# EasyEDA Pro project 2024_01_03_bar_IO_module.eprj

# Schematic Schematic1_1
Create Date: 2024-01-04; Page Name: P1; Project Name: 2024_01_03_bar_IO_module; Schematic Name: Schematic1_1; Update Date: 2024-01-04; Company: EasyEDA.com; Drawed: EasyEDA Pro; Page Size: A4; Part Number: JLCPCB-002; Reviewed: EasyEDA Pro; Version: V0.1
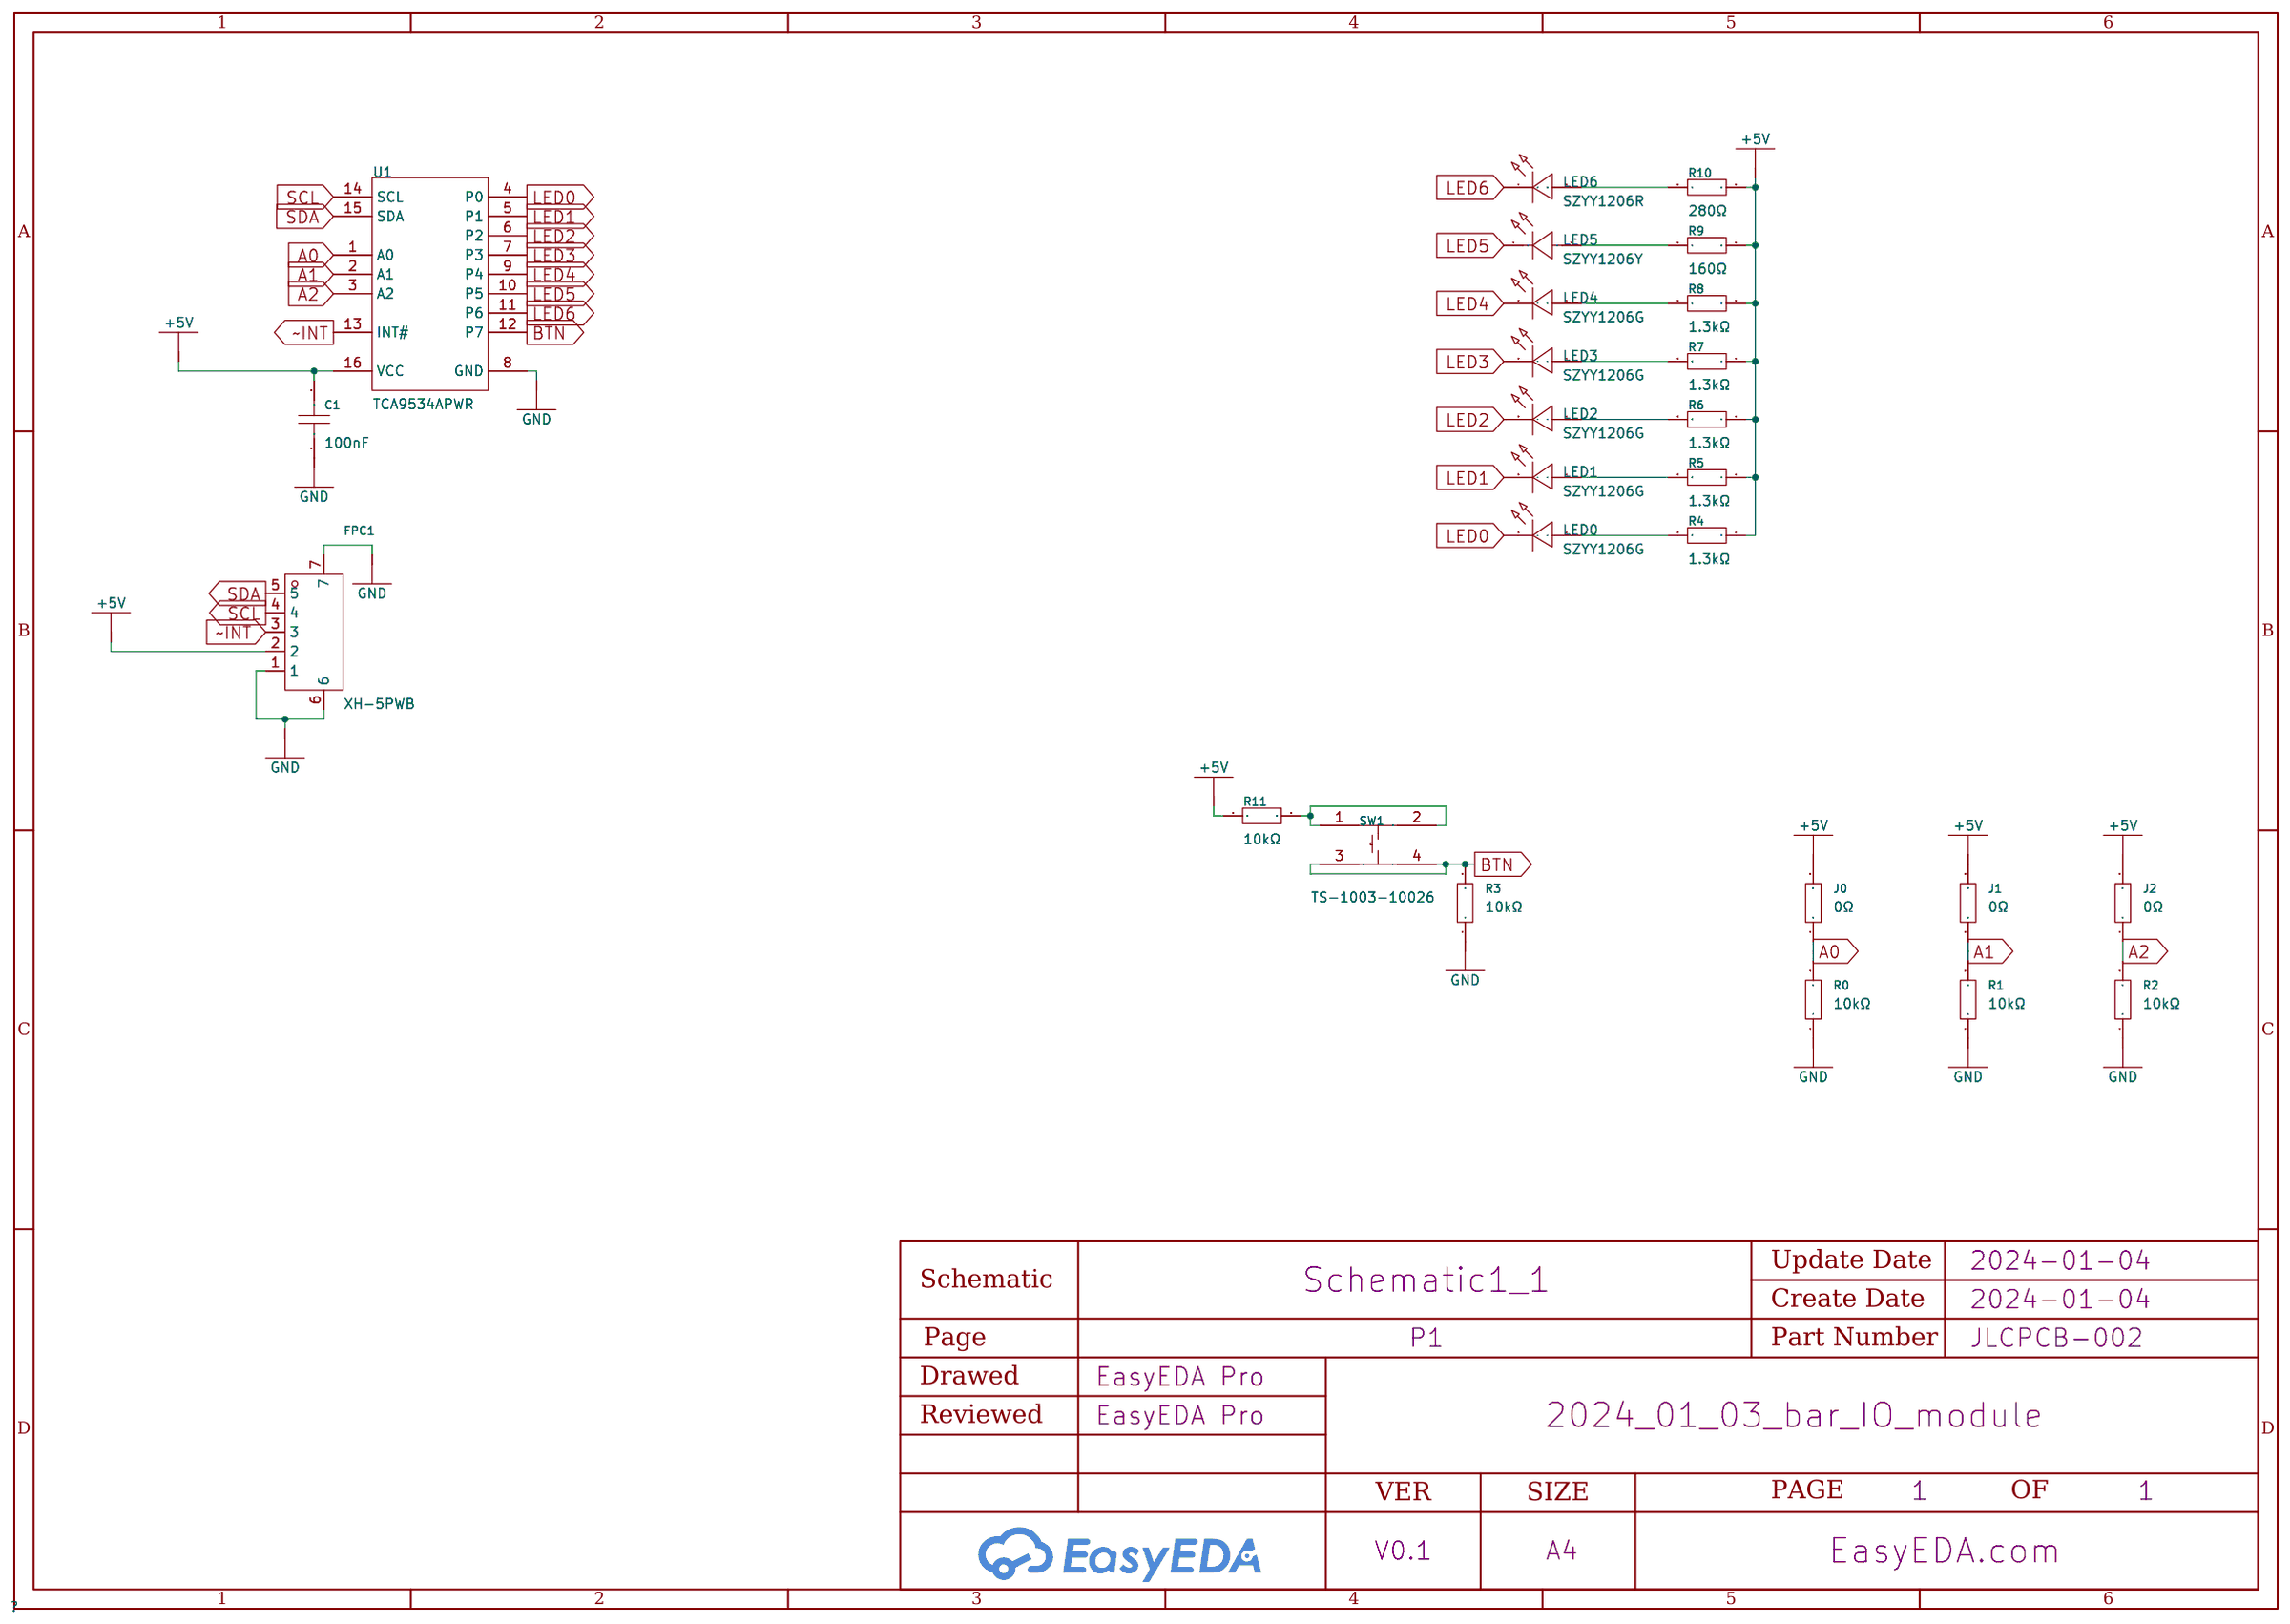
[diagram p0: schematic sheet]

## Parts
C1  100nF  [C0603]
FPC1  XH-5PWB  [CONN-SMD_5P-P2.50_DEALON_XH-5PWB]
J0  0Ω  [R0805]
J1  0Ω  [R0805]
J2  0Ω  [R0805]
LED0  SZYY1206G  [LED1206-R-RD]
LED1  SZYY1206G  [LED1206-R-RD]
LED2  SZYY1206G  [LED1206-R-RD]
LED3  SZYY1206G  [LED1206-R-RD]
LED4  SZYY1206G  [LED1206-R-RD]
LED5  SZYY1206Y  [LED1206-R-RD]
LED6  SZYY1206R  [LED1206-R-RD]
R0  10kΩ  [R0603]
R1  10kΩ  [R0603]
R2  10kΩ  [R0603]
R3  10kΩ  [R0603]
R4  1.3kΩ  [R0603]
R5  1.3kΩ  [R0603]
R6  1.3kΩ  [R0603]
R7  1.3kΩ  [R0603]
R8  1.3kΩ  [R0603]
R9  160Ω  [R0603]
R10  280Ω  [R0603]
R11  10kΩ  [R0603]
SW1  TS-1003-10026  [SW-TH_4P-L12.0-W12.0-P5.00-LS12.5]
U1  TCA9534APWR  [TSSOP-16_L5.0-W4.4-P0.65-LS6.4-BL]

## Library data of the parts
C1 = HMK107B7104KAHT: Capacitance: Tolerance:±10% Tolerance:±10% Voltage Rated: Temperature Coefficient:; LCSC Part Name: 100nF ±10% 100V MBASH168SB7104KTNA01; Supplier Part: C268011; Manufacturer: TAIYO YUDEN(太诱); Supplier Footprint: 0603; JLCPCB Part Class: Extended Part; Datasheet: https://atta.szlcsc.com/upload/public/pdf/source/20180820/C268011_073FA47FA3BE608543F06897344E2736.pdf; Supplier: LCSC; Tolerance: ±10%
FPC1 = XH-5PWB: Pins Structure:1x5P Pitch:2.5mm Mounting Style:Surface Mount Row Spacing:- Number of Pins:5P Number of Rows:1 Number of PINs Per Row:5 Reference Series:XH Current Rating (Max):3A Operating Temperature Range:-25℃~+85℃ Operating Temperature Range:-25℃~+85℃; LCSC Part Name: 1x5P 间距:2.5mm 卧贴 系列:XH; Supplier Part: C2905027; Manufacturer: DEALON(德艺隆); Supplier Footprint: SMD,P=2.5mm,卧贴; JLCPCB Part Class: Extended Part; Datasheet: https://atta.szlcsc.com/upload/public/pdf/source/20211025/6C2B75DB1AEBD099C7E95723735B67A6.pdf; Supplier: LCSC; Pins Structure: 1x5P; Pitch: 2.5mm; Mounting Style: Surface Mount; Number of Pins: 5P; Number of Rows: 1; Number of PINs Per Row: 5; Reference Series: XH; Current Rating (Max): 3A; Operating Temperature Range: -25℃~+85℃
J0-J2 = 0805W8F1002T5E: Resistance:10000Ω Tolerance:±1% Tolerance:±1% Power(Watts): Overload Voltage (Max): Temperature Coefficient:±100ppm/℃ Temperature Coefficient:±100ppm/℃ Type:Thick Film Resistors Operating Temperature Range:-55℃~+155℃ Operating Temperature Range:-55℃~+155℃; LCSC Part Name: 10kΩ ±1% 125mW 厚膜电阻; Supplier Part: C17414; Manufacturer: UNI-ROYAL(厚声); Supplier Footprint: 0805; JLCPCB Part Class: Basic Part; Datasheet: https://atta.szlcsc.com/upload/public/pdf/source/20200306/C422600_1E6D84923E4A46A82E41ADD87F860B5C.pdf; Supplier: LCSC; Tolerance: ±1%; Temperature Coefficient: ±100ppm/℃; Type: Thick Film Resistors; Operating Temperature Range: -55℃~+155℃
LED0-LED4 = SZYY1206G: Emitted Color:Emerald; LCSC Part Name: 翠绿; Supplier Part: C434439; Manufacturer: yongyu(永裕光电); Supplier Footprint: 1206; JLCPCB Part Class: Extended Part; Datasheet: https://atta.szlcsc.com/upload/public/pdf/source/20200628/C434439_0A6287F1EA2604FB8C8003896F01CB92.pdf; Supplier: LCSC; Emitted Color: Emerald
LED5 = SZYY1206Y: Emitted Color:yellow Diode Configuration:- Lens Color:Colorless transparence Dominant Wavelength:584nm~594nm Dominant Wavelength:584nm~594nm Peak Wavelength:596nm Color Temperature:- Color Temperature:- Forward Current:10mA Power Dissipation:40mW Viewing; LCSC Part Name: 黄灯; Supplier Part: C434443; Manufacturer: yongyu(永裕光电); Supplier Footprint: 1206; JLCPCB Part Class: Extended Part; Datasheet: https://atta.szlcsc.com/upload/public/pdf/source/20200827/C434443_5A3E9BDFE35964C13174CBFD2349B1CE.pdf; Supplier: LCSC; Emitted Color: yellow; Lens Color: Colorless transparence; Dominant Wavelength: 584nm~594nm; Peak Wavelength: 596nm; Forward Current: 10mA; Power Dissipation: 40mW; Viewing Angle: 120°; Operating Temperature: -40℃~+85℃
LED6 = SZYY1206R: Emitted Color:红灯 Diode Configuration:- Lens Color:Colorless transparence Dominant Wavelength:615nm~630nm Dominant Wavelength:615nm~630nm Peak Wavelength:645nm Color Temperature:- Color Temperature:- Forward Current:20mA Power Dissipation:40mW Viewing Angl; LCSC Part Name: 红灯; Supplier Part: C434438; Manufacturer: yongyu(永裕光电); Supplier Footprint: 1206; JLCPCB Part Class: Extended Part; Datasheet: https://atta.szlcsc.com/upload/public/pdf/source/20200628/C434438_2D67D2A0D30E1ECD9789F51185A39ACF.pdf; Supplier: LCSC; Emitted Color: 红灯; Lens Color: Colorless transparence; Dominant Wavelength: 615nm~630nm; Peak Wavelength: 645nm; Forward Current: 20mA; Power Dissipation: 40mW; Viewing Angle: 120°; Operating Temperature: -40℃~+85℃
R0-R3 R11 = 0603WAF1002T5E: Resistance:10000Ω Tolerance:±1% Tolerance:±1% Power(Watts): Overload Voltage (Max): Temperature Coefficient:±100ppm/℃ Temperature Coefficient:±100ppm/℃ Type:Thick Film Resistors Operating Temperature Range:-55℃~+155℃ Operating Temperature Range:-55℃~+155℃; LCSC Part Name: 10kΩ ±1% 100mW 厚膜电阻; Supplier Part: C25804; Manufacturer: UNI-ROYAL(厚声); Supplier Footprint: 0603; JLCPCB Part Class: Basic Part; Datasheet: https://atta.szlcsc.com/upload/public/pdf/source/20200306/C422600_1E6D84923E4A46A82E41ADD87F860B5C.pdf; Supplier: LCSC; Tolerance: ±1%; Temperature Coefficient: ±100ppm/℃; Type: Thick Film Resistors; Operating Temperature Range: -55℃~+155℃
R4-R8 = 0603WAF1002T5E: Resistance:10000Ω Tolerance:±1% Tolerance:±1% Power(Watts): Overload Voltage (Max): Temperature Coefficient:±100ppm/℃ Temperature Coefficient:±100ppm/℃ Type:Thick Film Resistors Operating Temperature Range:-55℃~+155℃ Operating Temperature Range:-55℃~+155℃; LCSC Part Name: 10kΩ ±1% 100mW 厚膜电阻; Supplier Part: C25804; Manufacturer: UNI-ROYAL(厚声); Manufacturer Part: CQ03WAJ0132T5E; Supplier Footprint: 0603; JLCPCB Part Class: Basic Part; Datasheet: https://atta.szlcsc.com/upload/public/pdf/source/20200306/C422600_1E6D84923E4A46A82E41ADD87F860B5C.pdf; Supplier: LCSC; Tolerance: ±1%; Temperature Coefficient: ±100ppm/℃; Type: Thick Film Resistors; Operating Temperature Range: -55℃~+155℃
R9 = 0603WAF1002T5E: Resistance:10000Ω Tolerance:±1% Tolerance:±1% Power(Watts): Overload Voltage (Max): Temperature Coefficient:±100ppm/℃ Temperature Coefficient:±100ppm/℃ Type:Thick Film Resistors Operating Temperature Range:-55℃~+155℃ Operating Temperature Range:-55℃~+155℃; LCSC Part Name: 10kΩ ±1% 100mW 厚膜电阻; Supplier Part: C25804; Manufacturer: UNI-ROYAL(厚声); Manufacturer Part: FRC0603J161 TS; Supplier Footprint: 0603; JLCPCB Part Class: Basic Part; Datasheet: https://atta.szlcsc.com/upload/public/pdf/source/20200306/C422600_1E6D84923E4A46A82E41ADD87F860B5C.pdf; Supplier: LCSC; Tolerance: ±1%; Temperature Coefficient: ±100ppm/℃; Type: Thick Film Resistors; Operating Temperature Range: -55℃~+155℃
R10 = 0603WAF1002T5E: Resistance:10000Ω Tolerance:±1% Tolerance:±1% Power(Watts): Overload Voltage (Max): Temperature Coefficient:±100ppm/℃ Temperature Coefficient:±100ppm/℃ Type:Thick Film Resistors Operating Temperature Range:-55℃~+155℃ Operating Temperature Range:-55℃~+155℃; LCSC Part Name: 10kΩ ±1% 100mW 厚膜电阻; Supplier Part: C25804; Manufacturer: UNI-ROYAL(厚声); Manufacturer Part: ARG03BTC2800; Supplier Footprint: 0603; JLCPCB Part Class: Basic Part; Datasheet: https://atta.szlcsc.com/upload/public/pdf/source/20200306/C422600_1E6D84923E4A46A82E41ADD87F860B5C.pdf; Supplier: LCSC; Tolerance: ±1%; Temperature Coefficient: ±100ppm/℃; Type: Thick Film Resistors; Operating Temperature Range: -55℃~+155℃
SW1 = TS-1003-10026: Circuit:SPST Actuator Style:Round Button Switch Length:12mm Switch Width:12mm Switch Height:10mm Contact Current:50mA Voltage Rating (DC):12V Mounting Style:Straight With Lamp:- Mechanical Life:-; LCSC Part Name: 12*12*10mm 直插 轻触开关; Supplier Part: C455212; Manufacturer: XUNPU(讯普); Supplier Footprint: 插件,12x12mm; JLCPCB Part Class: Extended Part; Datasheet: https://atta.szlcsc.com/upload/public/pdf/source/20191118/C455216_ADAA77A5CDCA4F204D54AEEB191E69AC.pdf; Supplier: LCSC; Circuit: SPST; Actuator Style: Round Button; Switch Length: 12mm; Switch Width: 12mm; Switch Height: 10mm; Contact Current: 50mA; Voltage Rating (DC): 12V; Mounting Style: Straight
U1 = TCA9534APWR: Interface:I²C Number of I/O:8 Interrupt Output:有中断输出 Output Type: Clock Frequency:400kHz Supply Voltage:1.65V~5.5V Supply Voltage:1.65V~5.5V Operating Temperature:-40℃~+85℃ Operating Temperature:-40℃~+85℃; LCSC Part Name: 具有中断输出和配置寄存器的低压8位I2C和系统管理总线(SMBUS)低功耗输入输出(I/O)扩展器; Supplier Part: C206010; Manufacturer: TI(德州仪器); Supplier Footprint: TSSOP-16; JLCPCB Part Class: Extended Part; Datasheet: https://atta.szlcsc.com/upload/public/pdf/source/20180412/C206010_5FAA77348B9BAC4966C7371A52F0BCDF.pdf; Supplier: LCSC; Interface: I²C; Number of I/O: 8; Interrupt Output: 有中断输出; Clock Frequency: 400kHz; Supply Voltage: 1.65V~5.5V; Operating Temperature: -40℃~+85℃

## Nets
+5V: C1.2 FPC1.2 J0.2 J1.2 J2.2 R4.1 R5.1 R6.1 R7.1 R8.1 R9.1 R10.1 R11.1 U1.16(VCC)
GND: C1.1 FPC1.1 FPC1.6 FPC1.7 R0.1 R1.1 R2.1 R3.1 U1.8(GND)
A0: J0.1 R0.2 U1.1(A0)
A1: J1.1 R1.2 U1.2(A1)
A2: J2.1 R2.2 U1.3(A2)
BTN: R3.2 SW1.3 SW1.4 U1.12(P7)
LED0: LED0.2(-) U1.4(P0)
LED1: LED1.2(-) U1.5(P1)
LED2: LED2.2(-) U1.6(P2)
LED3: LED3.2(-) U1.7(P3)
LED4: LED4.2(-) U1.9(P4)
LED5: LED5.1(K) U1.10(P5)
LED6: LED6.1 U1.11(P6)
SCL: FPC1.4 U1.14(SCL)
SDA: FPC1.5 U1.15(SDA)
~INT: FPC1.3 U1.13(INT#)
$1N4179: LED0.1(+) R4.2
$1N4410: LED4.1(+) R8.2
$1N4413: LED3.1(+) R7.2
$1N4416: LED2.1(+) R6.2
$1N4419: LED1.1(+) R5.2
$1N7785: R11.2 SW1.1 SW1.2
Net-(LED5-2): LED5.2(A) R9.2
Net-(LED6-2): LED6.2 R10.2

# Board PCB1_1
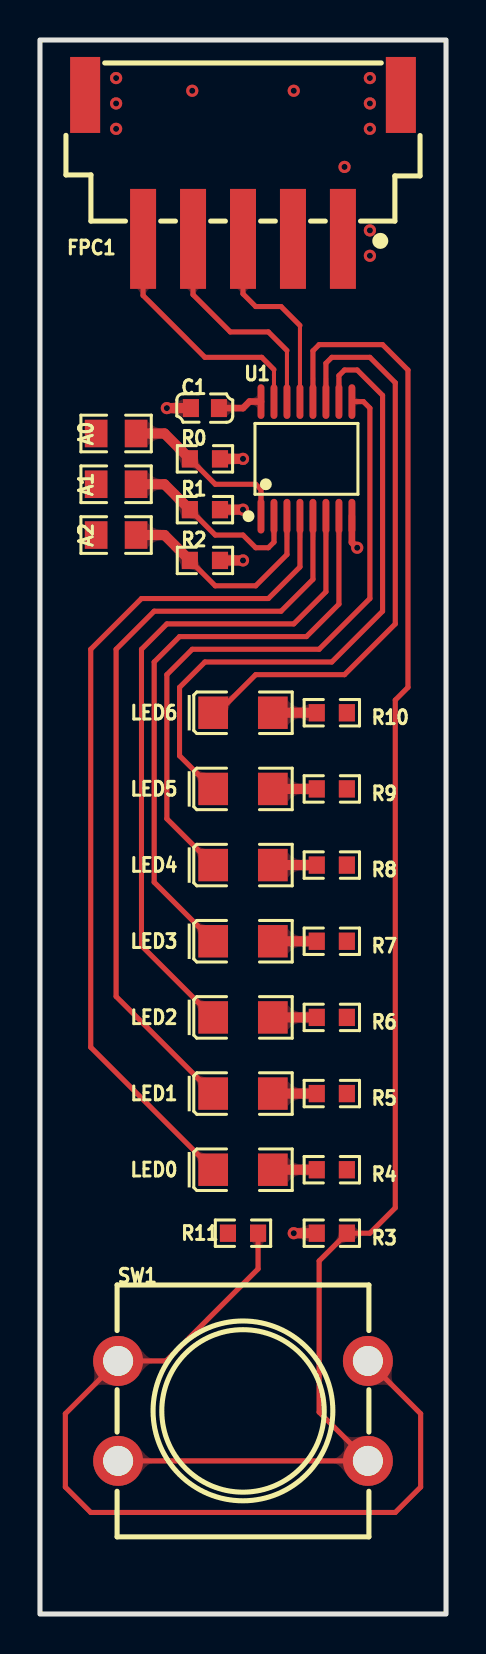
[diagram p1: board, top side]
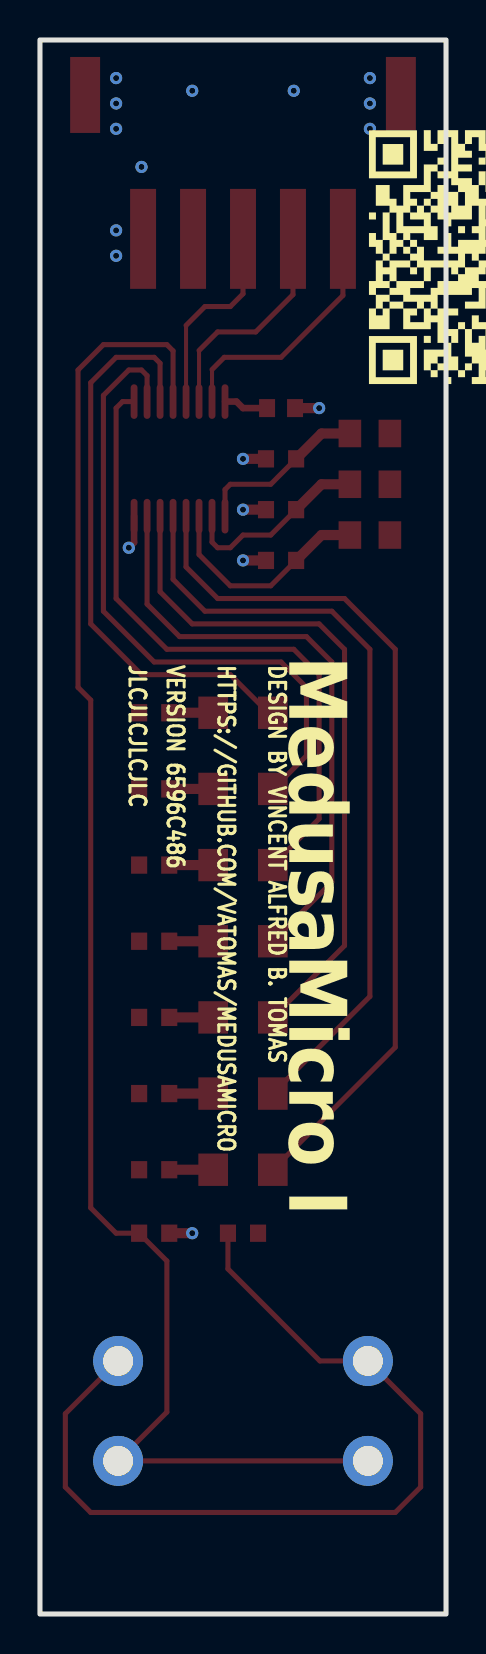
[diagram p2: board, bottom side, seen from below]

Outline 20.32 x 78.74 mm; copper layers: Top Layer, Bottom Layer. Coordinates in mm from the lower left corner of the outline.
Outline path: rectangle 0,78.74 20.32,0
Stack: Top Layer 0.035mm / Dielectric1 1.51mm FR4 er 4.5 / Bottom Layer 0.035mm

## Design rules (mm)
template: Custom Config
spacing copperThickness1oz (default): track to track 0.102, other pairs 0.152 to 0.3
spacing copperThickness2oz: track to track 0.203, other pairs 0.152 to 0.3
track width copperThickness1oz (default): min 0.127, default 0.254, max 2.54
track width copperThickness2oz: min 0.203, default 0.254, max 2.54
differential pair differentialPair (default): width min 0.127, default 0.254, max 2.54; gap min 0.152, default 0.152
via viaSize (default): diameter min 0.5, default 0.61, max 10; hole min 0.3, default 0.305, max 6.3

## Placement (name value [footprint] x y rotation side)
A0  0Ω  [R0805]  3.81 59.06 180 top
A1  0Ω  [R0805]  3.81 56.52 180 top
A2  0Ω  [R0805]  3.81 53.98 180 top
C1  100nF  [C0603]  8.25 60.33 0 top
FPC1  XH-5PWB  [CONN-SMD_5P-P2.50_DEALON_XH-5PWB]  10.16 72.39 180 top
LED0  SZYY1206G  [LED1206-R-RD]  10.16 22.23 0 top
LED1  SZYY1206G  [LED1206-R-RD]  10.16 26.04 0 top
LED2  SZYY1206G  [LED1206-R-RD]  10.16 29.85 0 top
LED3  SZYY1206G  [LED1206-R-RD]  10.16 33.66 0 top
LED4  SZYY1206G  [LED1206-R-RD]  10.16 37.47 0 top
LED5  SZYY1206Y  [LED1206-R-RD]  10.16 41.28 0 top
LED6  SZYY1206R  [LED1206-R-RD]  10.16 45.09 0 top
R0  10kΩ  [R0603]  8.25 57.79 180 top
R1  10kΩ  [R0603]  8.25 55.25 180 top
R2  10kΩ  [R0603]  8.25 52.71 180 top
R3  10kΩ  [R0603]  14.61 19.05 0 top
R4  1.3kΩ  [R0603]  14.61 22.23 180 top
R5  1.3kΩ  [R0603]  14.61 26.04 180 top
R6  1.3kΩ  [R0603]  14.61 29.85 180 top
R7  1.3kΩ  [R0603]  14.61 33.66 180 top
R8  1.3kΩ  [R0603]  14.61 37.47 180 top
R9  160Ω  [R0603]  14.61 41.28 180 top
R10  280Ω  [R0603]  14.61 45.09 180 top
R11  10kΩ  [R0603]  10.16 19.05 0 top
SW1  TS-1003-10026  [SW-TH_4P-L12.0-W12.0-P5.00-LS12.5]  10.16 10.16 0 top
U1  TCA9534APWR  [TSSOP-16_L5.0-W4.4-P0.65-LS6.4-BL]  13.34 57.79 0 top

## Footprints (pads in the part's own frame, mm; a bottom-side part is the same pattern mirrored in y, then rotated)
C0603
  rect 0.8x0.9 smd: 1(-0.7,0) 2(0.7,0)
CONN-SMD_5P-P2.50_DEALON_XH-5PWB
  rect 1.3x5 smd: 1(-5,3.6) 2(-2.5,3.6) 3(0,3.6) 4(2.5,3.6) 5(5,3.6)
  rect 1.5x3.8 smd: 6(-7.9,-3.6) 7(7.9,-3.6)
LED1206-R-RD
  rect 1.485x1.62 smd: 1(1.492,0) 2(-1.492,0)
R0603
  rect 0.806x0.864 smd: 1(-0.753,0) 2(0.753,0)
R0805
  rect 1.133x1.377 smd: 1(-1,0) 2(1,0)
SW-TH_4P-L12.0-W12.0-P5.00-LS12.5
  round 2.5 hole 1.5: 1(-6.25,2.5) 2(6.25,2.5) 3(-6.25,-2.5) 4(6.25,-2.5)
TSSOP-16_L5.0-W4.4-P0.65-LS6.4-BL
  oval 0.343x1.732 smd: 1(-2.275,-2.866) 2(-1.625,-2.866) 3(-0.975,-2.866) 4(-0.325,-2.866) 5(0.325,-2.866) 6(0.975,-2.866) 7(1.625,-2.866) 8(2.275,-2.866) 9(2.275,2.866) 10(1.625,2.866) 11(0.975,2.866) 12(0.325,2.866) 13(-0.325,2.866) 14(-0.975,2.866) 15(-1.625,2.866) 16(-2.275,2.866)

## Nets
+5V: A0.2 A1.2 A2.2 C1.2 FPC1.2 R4.1 R5.1 R6.1 R7.1 R8.1 R9.1 R10.1 R11.1 U1.16
GND: C1.1 FPC1.1 FPC1.6 FPC1.7 R0.1 R1.1 R2.1 R3.1 U1.8
A0: A0.1 R0.2 U1.1
A1: A1.1 R1.2 U1.2
A2: A2.1 R2.2 U1.3
BTN: R3.2 SW1.3 SW1.4 U1.12
LED0: LED0.2 U1.4
LED1: LED1.2 U1.5
LED2: LED2.2 U1.6
LED3: LED3.2 U1.7
LED4: LED4.2 U1.9
LED5: LED5.2 U1.10
LED6: LED6.2 U1.11
SCL: FPC1.4 U1.14
SDA: FPC1.5 U1.15
~INT: FPC1.3 U1.13
$1N4179: LED0.1 R4.2
$1N4404: LED6.1 R10.2
$1N4407: LED5.1 R9.2
$1N4410: LED4.1 R8.2
$1N4413: LED3.1 R7.2
$1N4416: LED2.1 R6.2
$1N4419: LED1.1 R5.2
$1N7785: R11.2 SW1.1 SW1.2

## Via types
v1: diameter 0.61, hole 0.305, Top Layer to Bottom Layer, 17 vias

## Routing (per net, layer and track width the routed paths; a pad name or vN(x,y) marks a point on that pad's centre or on a via; arc(x,y) is an arc through that point)
+5V: length 2.2
  Top Layer w0.33: U1.16 10.49,60.65 10.16,60.33 8.96,60.33
GND: length 7.5
  Top Layer w0.33: v1(15.88,53.34) 15.61,53.61 U1.8
  Top Layer w0.508: v1(6.35,60.33) C1.1 ; R1.1 v1(10.16,55.25) ; R2.1 v1(10.16,52.71) ; R0.1 v1(10.16,57.79) ; v1(12.7,19.05) R3.1
  vias: v1(3.81,76.84) v1(3.81,75.57) v1(3.81,74.3) v1(7.62,76.2) v1(12.7,76.2) v1(15.24,72.39) v1(16.51,76.84) v1(16.51,75.57) v1(16.51,74.3) v1(16.51,69.22) v1(16.51,67.95)
A0: length 8.7
  Top Layer w0.254: U1.1 11.06,56.25 10.8,56.52 8.77,56.52 R0.2
  Top Layer w0.508: R0.2 6.23,59.06 A0.1
A1: length 9.6
  Top Layer w0.254: R1.2 8.77,53.98 10.16,53.98 10.8,53.34 11.43,53.34 11.71,53.62 U1.2
  Top Layer w0.508: R1.2 6.23,56.52 A1.1
A2: length 11.2
  Top Layer w0.254: U1.3 12.36,53 10.8,51.44 8.77,51.44 R2.2
  Top Layer w0.508: R2.2 6.23,53.98 A2.1
BTN: length 78.5
  Top Layer w0.254: U1.12 13.66,63.19 13.97,63.5 17.15,63.5 18.42,62.23 18.42,46.36 17.78,45.72 17.78,20.32 16.51,19.05 R3.2 13.97,17.66 13.97,10.1 SW1.4 SW1.3
LED0: length 43.3
  Top Layer w0.254: U1.4 13.01,52.38 11.43,50.8 5.08,50.8 2.54,48.26 2.54,28.35 LED0.2
LED1: length 38.7
  Top Layer w0.254: U1.5 13.66,51.76 12.06,50.17 5.72,50.17 3.81,48.26 3.81,30.89 LED1.2
LED2: length 34.1
  Top Layer w0.254: U1.6 14.31,51.14 12.7,49.53 6.35,49.53 5.08,48.26 5.08,33.43 LED2.2
LED3: length 30
  Top Layer w0.254: LED3.2 5.72,36.61 5.72,47.63 6.99,48.9 13.34,48.9 14.96,50.52 U1.7
LED4: length 32.8
  Top Layer w0.254: LED4.2 6.35,39.78 6.35,46.99 7.62,48.26 13.97,48.26 16.51,50.8 16.51,60.33 16.18,60.65 U1.9
LED5: length 32.4
  Top Layer w0.254: 8.64,41.28 6.99,42.93 6.99,46.36 8.25,47.63 14.61,47.63 17.15,50.17 17.15,60.96 15.88,62.23 15.24,62.23 14.96,61.95 U1.10
LED6: length 28.8
  Top Layer w0.254: 8.89,45.09 10.8,46.99 15.24,46.99 17.78,49.53 17.78,61.6 16.51,62.87 14.61,62.87 14.31,62.57 U1.11
SCL: length 10.6
  Top Layer w0.203: 12.36,61.29 12.36,63.21
  Top Layer w0.254: 12.36,63.21 11.43,64.14 9.53,64.14 7.66,66 FPC1.4
SDA: length 11.9
  Top Layer w0.203: 11.71,61.29 11.71,62.25
  Top Layer w0.254: 11.71,62.25 11.1,62.87 8.25,62.87 5.16,65.96 FPC1.5
~INT: length 10.1
  Top Layer w0.203: U1.13 13.01,64.46
  Top Layer w0.254: FPC1.3 10.16,66.04 10.8,65.41 12.06,65.41 13.01,64.46
$1N4179: length 2.2
  Top Layer w0.508: R4.2 LED0.1
$1N4404: length 2.2
  Top Layer w0.508: 11.68,45.09 R10.2
$1N4407: length 2.2
  Top Layer w0.508: R9.2 11.68,41.28
$1N4410: length 2.2
  Top Layer w0.508: R8.2 LED4.1
$1N4413: length 2.2
  Top Layer w0.508: R7.2 LED3.1
$1N4416: length 2.2
  Top Layer w0.508: R6.2 LED2.1
$1N4419: length 2.2
  Top Layer w0.508: R5.2 LED1.1
$1N7785: length 44.3
  Top Layer w0.254: R11.2 10.91,17.26 6.31,12.66 SW1.1 1.27,10.02 1.27,6.35 2.54,5.08 17.78,5.08 19.05,6.35 19.05,10.02 SW1.2

## Copper pours and planes (outline as drawn; the poured copper is in the pictures)
+5V on Top Layer: 0,74.3 20.32,74.3 20.32,0 0,0
GND on Top Layer: 0,78.74 20.32,78.74 20.32,66.04 14.48,66.04 14.22,66.29 14.22,71.5 11.81,73.91 0,73.91
GND on Bottom Layer: 0,78.74 20.32,78.74 20.32,0 0,0

Small or netless copper shapes (teardrops, artwork), in the pictures only: 68 on Top Layer

## Text on the board
Bottom Silkscreen Layer: DESIGN BY VINCENT ALFRED B. TOMAS | HTTPS://GITHUB.COM/VATOMAS/MEDUSAMICRO | VERSION 6596C486 | JLCJLCJLCJLC | MedusaMicro I
